# EAGLE design iSkipper.Ver.2.0.2 (EAGLE 9.0.1)
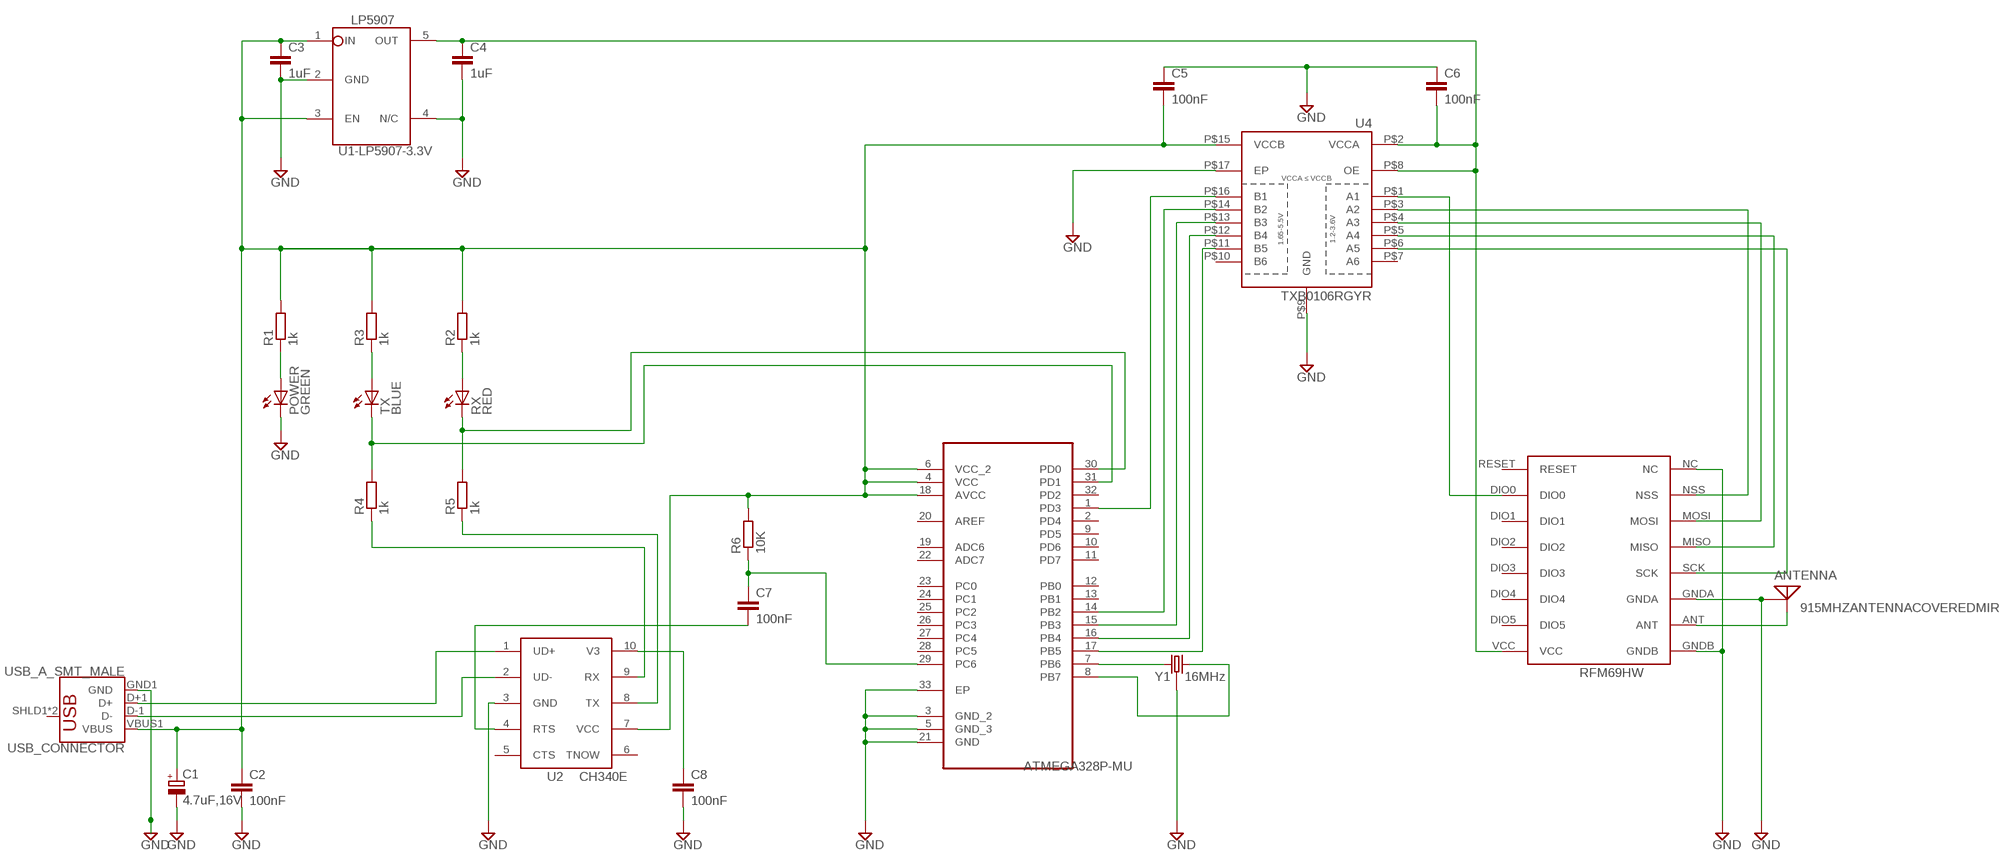
[diagram p0: schematic, sheet 1]

## Parts
ANTENNA  915MHZANTENNACOVEREDMIRROR  [COVERED-MIRROR]
C1  4.7uF,16V  CPOL-EUCT3216  [CT3216]
C2  100nF  CC0603  [C0603]
C3  1uF  CC0603  [C0603]
C4  1uF  CC0603  [C0603]
C5  100nF  CC0603  [C0603]
C6  100nF  CC0603  [C0603]
C7  100nF  CC0603  [C0603]
C8  100nF  CC0603  [C0603]
POWER  GREEN  LEDSML0805  [SML0805]
R1  1k  RR0603  [R0603]
R2  1k  RR0603  [R0603]
R3  1k  RR0603  [R0603]
R4  1k  RR0603  [R0603]
R5  1k  RR0603  [R0603]
R6  10K  RR0603  [R0603]
RFM69HW  RFM69HW  [RFM]
RX  RED  LEDSML0805  [SML0805]
TX  BLUE  LEDSML0805  [SML0805]
U2  CH340ESMD  [MSOP10]
U4  TXB0106RGYR  [VQFN-16]
U$1  U1-LP5907-3.3V  LP5907  [SOT-23]
U$3  ATMEGA328P-MU  [QFN50P500X500X100-33N]
USB_CONNECTOR  USB_A_SMT_MALE  [USB-A-SMT-MALE]
Y1  16MHz  CRYSTAL-GROUNDEDSMD-3.2X2.5  [CRYSTAL-SMD-3.2X2.5MM]

## Nets
GND [Ground]: ANTENNA.P$2(GND) C1.- C2.2 C3.2 C4.2 C5.1 C6.1 C8.2 POWER.C RFM69HW.GNDA RFM69HW.GNDB RFM69HW.NC U2.3(GND) U4.P$9(GND) U4.P$17(EP) U$1.2(GND) U$1.4(N/C) U$3.3(GND_2) U$3.5(GND_3) U$3.21(GND) U$3.33(EP) USB_CONNECTOR.GND1(GND) Y1.2 Y1.4
N$1: U$3.7(PB6) Y1.1
N$2: U$3.8(PB7) Y1.3
N$3 [+5.0V]: C1.+ C2.1 C3.1 C5.2 R1.2 R2.2 R3.2 R6.2 U2.7(VCC) U4.P$15(VCCB) U$1.1(IN) U$1.3(EN) U$3.4(VCC) U$3.6(VCC_2) U$3.18(AVCC) USB_CONNECTOR.VBUS1(VBUS)
N$4: C7.2 U2.4(RTS)
N$5: U2.1(UD+) USB_CONNECTOR.D+1(D+)
N$6 [+3.3V]: C4.1 C6.2 RFM69HW.VCC U4.P$2(VCCA) U4.P$8(OE) U$1.5(OUT)
N$7: POWER.A R1.1
N$8: R3.1 TX.A
N$9: U2.2(UD-) USB_CONNECTOR.D-1(D-)
N$10: R2.1 RX.A
N$11: R5.1 U2.8(TX)
N$12: C8.1 U2.10(V3)
N$13: R4.1 U2.9(RX)
N$14: U4.P$14(B2) U$3.14(PB2)
N$15: R4.2 TX.C U$3.31(PD1)
N$16: R5.2 RX.C U$3.30(PD0)
N$17: U4.P$16(B1) U$3.1(PD3)
N$18: C7.1 R6.1 U$3.29(PC6)
N$19: ANTENNA.P$1(SIGNAL) RFM69HW.ANT
N$22: RFM69HW.SCK U4.P$6(A5)
N$23: RFM69HW.DIO0 U4.P$1(A1)
N$24: RFM69HW.NSS U4.P$3(A2)
N$25: RFM69HW.MISO U4.P$5(A4)
N$26: RFM69HW.MOSI U4.P$4(A3)
N$28: U4.P$11(B5) U$3.17(PB5)
N$29: U4.P$12(B4) U$3.16(PB4)
N$30: U4.P$13(B3) U$3.15(PB3)
Unconnected: RFM69HW.DIO1 RFM69HW.DIO2 RFM69HW.DIO3 RFM69HW.DIO4 RFM69HW.DIO5 RFM69HW.RESET U2.5(CTS) U2.6(TNOW) U4.P$7(A6) U4.P$10(B6) U$3.2(PD4) U$3.9(PD5) U$3.10(PD6) U$3.11(PD7) U$3.12(PB0) U$3.13(PB1) U$3.19(ADC6) U$3.20(AREF) U$3.22(ADC7) U$3.23(PC0) U$3.24(PC1) U$3.25(PC2) U$3.26(PC3) U$3.27(PC4) U$3.28(PC5) U$3.32(PD2) USB_CONNECTOR.SHLD1(SHIELD) USB_CONNECTOR.SHLD2(SHIELD)

## Notes on the sheet
- CH340E

## Library data of the parts
ANTENNA = 915MhzAntenna:915MHZANTENNA
C1 = rcl:CPOL-EU: POLARIZED CAPACITOR, European symbol; SPICEPREFIX: C
C2-C8 = eagle-ltspice:C: CAPACITOR, European symbol; SPICEMODEL: NONE; SPICEPREFIX: C
POWER RX TX = led:LED: LED OSRAM: - CHIPLED LG R971, LG N971, LY N971, LG Q971, LY Q971, LO R971, LY R971 LH N974, LH R974 LS Q976, LO Q976, LY Q976 LO Q996 - Hyper CHIPLED LW Q18S LB Q993, LB Q99A, LB R99A - SideLED LS A670, LO A670, LY A670, LG A670, LP A670 LB A673, LV A673, LT A673, LW A673 LH A674 LY A675 LS A676, LA A676, LO A676, LY A676, LW A676 LS A679, LY A679, LG A679 - Hyper Micro SIDELED® LS Y876, LA Y876, LO Y876, LY Y876 LT Y87S - SmartLED LW L88C, LW L88S LB L89C, LB L89S, LG L890 LS L89K, LO L89K, LY L89K LS L896, LA L896, LO L896, LY L896 - TOPLED LS T670, LO T670, LY T670, LG T670, LP T670 LSG T670, LSP T670, LSY T670, LOP T670, LYG T670 LG T671, LOG T671, LSG T671 LB T673, LV T673, LT T673, LW T673 LH T674 LS T676, LA T676, LO T676, LY T676, LB T676, LH T676, LSB T676, LW T676 LB T67C, LV T67C, LT T67C, LS T67K, LO T67K, LY T67K, LW E67C LS E67B, LA E67B, LO E67B, LY E67B, LB E67C, LV E67C, LT E67C LW T67C LS T679, LY T679, LG T679 LS T770, LO T770, LY T770, LG T770, LP T770 LB T773, LV T773, LT T773, LW T773 LH T774 LS E675, LA E675, LY E675, LS T675 LS T776, LA T776, LO T776, LY T776, LB T776 LHGB T686 LT T68C, LB T68C - Hyper Mini TOPLED® LB M676 - Mini TOPLED Santana® LG M470 LS M47K, LO M47K, LY M47K Source: http://www.osram.convergy.de LUXEON: - LUMILED® LXK2-PW12-R00, LXK2-PW12-S00, LXK2-PW14-U00, LXK2-PW14-V00 LXK2-PM12-R00, LXK2-PM12-S00, LXK2-PM14-U00 LXK2-PE12-Q00, LXK2-PE12-R00, LXK2-PE12-S00, LXK2-PE14-T00, LXK2-PE14-U00 LXK2-PB12-K00, LXK2-PB12-L00, LXK2-PB12-M00, LXK2-PB14-N00, LXK2-PB14-P00, LXK2-PB14-Q00 LXK2-PR12-L00, LXK2-PR12-M00, LXK2-PR14-Q00, LXK2-PR14-R00 LXK2-PD12-Q00, LXK2-PD12-R00, LXK2-PD12-S00 LXK2-PH12-R00, LXK2-PH12-S00 LXK2-PL12-P00, LXK2-PL12-Q00, LXK2-PL12-R00 Source: www.luxeon.com KINGBRIGHT: KA-3528ASYC Source: www.kingbright.com
R1-R6 = eagle-ltspice:R: RESISTOR, European symbol; SPICEMODEL: NONE; SPICEPREFIX: R
RFM69HW = hoperf:RFM69HW; TYPE: RFM69HW
U2 = CH340E:CH340E: WCH.CN/CH340E See DataSheet： wch.cn <http://www.wch.cn/downloads/CH340DS1_PDF.html>
U4 = TXB0106RGYR:TXB0106RGYR
U$1 = ti_lp5907:LP5907: LP5907 Regulator
U$3 = Ava:ATMEGA328P-MU: Programmable Flash; MPN: ATMEGA328P-MU; OC_FARNELL: 1748522; OC_NEWARK: 26R2526; PACKAGE: QFN-32; SUPPLIER: Atmel
USB_CONNECTOR = SparkFun-Connectors:USB_A: USB-A Connector Male and female variants, as well as PTH and SMT variants SparkFun Products: SparkFun XBee Explorer Dongle <https://www.sparkfun.com/products/11697> PTH Male SparkFun MicroView-USB Programmer <https://www.sparkfun.com/products/12924> SMT Male SparkFun USB Type A Female Breakout <https://www.sparkfun.com/products/12700> SMT Female; PROD_ID: CONN-11499
Y1 = SparkFun-Clocks:CRYSTAL-GROUNDED: Crystals w/ Ground Pin (Generic) These are passive quartz crystals, which can be used as a clock source for a microcontroller. Crystal's are usually two-terminal devices. A third terminal may be optionally connected to ground, as recommended by the manufaturer.

## Board
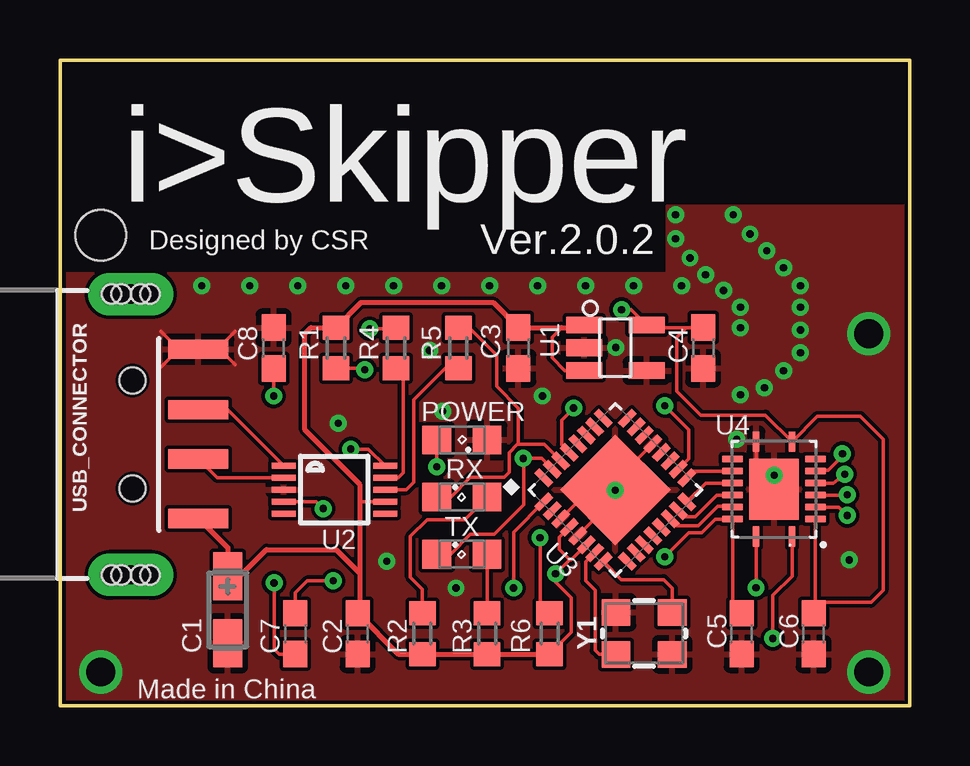
[diagram p1: board, top side]
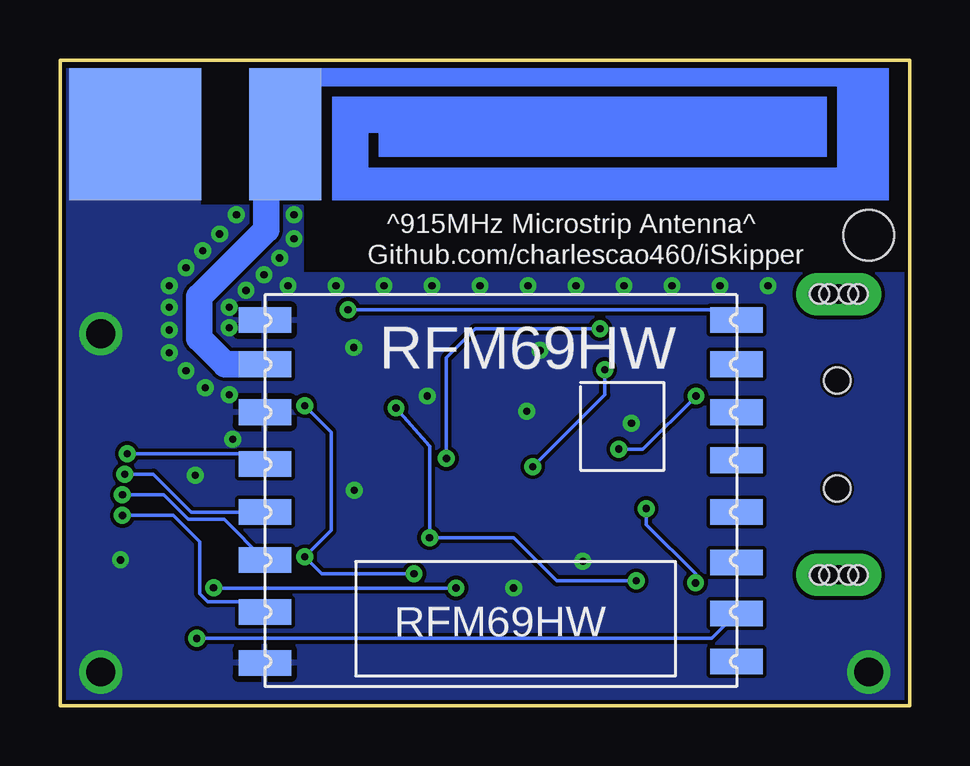
[diagram p2: board, bottom side, seen from below]

Size 35.4 x 26.9 mm. Coordinates in mm from the lower left corner, seen from the top.
Outline: 0,26.9 35.4,26.9 35.4,0 0,0 0,26.9
Copper layers (1*16): Top 0.035mm / dielectric 1.5mm / Bottom 0.035mm
Design rules "default *": minimum track width 6mil, minimum drill 0.3mm, track to track 6mil, track to pad 6mil, pad to pad 6mil, via to via 6mil, smd to smd 6mil, copper to edge 6mil, drill to drill 6mil, minimum pad ring 10mil, minimum via ring 8mil, stop-mask expansion 4mil, vias tented up to drill 20mil, thermal gap 10mil
Holes 2.1 mm at 1.7,19.6

### Footprints (pad centres in the part's own frame; a part is rotated, then mirrored left to right if it is on the bottom)
COVERED-MIRROR = smd 3 x 5.5: P$1 9,2.75 | smd 5.5 x 5.5: P$2 2.75,2.75
CT3216 = smd 2 x 1.2: + -1.4,0; - 1.4,0
C0603 = smd 1.1 x 1: 1 -0.85,0; 2 0.85,0
SML0805 = smd 1.2 x 1.2: A 1.05,0; C -1.05,0
R0603 = smd 1 x 1.1: 1 -0.85,0; 2 0.85,0
RFM = smd 2.184 x 1.067: ANT 19.651,2.889; DIO0 0,13.27; DIO1 0,11.143; DIO2 0,9.047; DIO3 0,6.889; DIO4 0,4.889; DIO5 0,2.889; GNDA 19.651,4.889; GNDB 19.651,1.048; MISO 19.651,9.047; MOSI 19.651,11.047; NC 19.651,15.334; NSS 19.651,13.206; RESET 0,15.27; SCK 19.651,7.048; VCC 0,1.048
MSOP10 = smd 1 x 0.25: 1 -2.113,1; 2 -2.113,0.5; 3 -2.113,0; 4 -2.113,-0.5; 5 -2.113,-1; 6 2.113,-1; 7 2.113,-0.5; 8 2.113,0; 9 2.113,0.5; 10 2.113,1
VQFN-16 = smd 0.85 x 0.28: P$1 -1.975,-0.75; P$8 1.975,-0.75; P$9 1.975,0.75; P$16 -1.975,0.75 | smd 0.28 x 0.85: P$2 -1.25,-1.725; P$3 -0.75,-1.725; P$4 -0.25,-1.725; P$5 0.25,-1.725; P$6 0.75,-1.725; P$7 1.25,-1.725; P$10 1.25,1.725; P$11 0.75,1.725; P$12 0.25,1.725; P$13 -0.25,1.725; P$14 -0.75,1.725; P$15 -1.25,1.725 | smd 2.55 x 2.05: P$17 0,0
SOT-23 = smd 1.5 x 0.7: 1 -1.3,0.95; 2 -1.3,0; 3 -1.3,-0.95; 4 1.3,-0.95; 5 1.3,0.95
QFN50P500X500X100-33N = smd 0.813 x 0.305: 1 -2.464,1.753; 2 -2.464,1.245; 3 -2.464,0.762; 4 -2.464,0.254; 5 -2.464,-0.254; 6 -2.464,-0.762; 7 -2.464,-1.245; 8 -2.464,-1.753; 17 2.464,-1.753; 18 2.464,-1.245; 19 2.464,-0.762; 20 2.464,-0.254; 21 2.464,0.254; 22 2.464,0.762; 23 2.464,1.245; 24 2.464,1.753 | smd 0.305 x 0.813: 9 -1.753,-2.464; 10 -1.245,-2.464; 11 -0.762,-2.464; 12 -0.254,-2.464; 13 0.254,-2.464; 14 0.762,-2.464; 15 1.245,-2.464; 16 1.753,-2.464; 25 1.753,2.464; 26 1.245,2.464; 27 0.762,2.464; 28 0.254,2.464; 29 -0.254,2.464; 30 -0.762,2.464; 31 -1.245,2.464; 32 -1.753,2.464 | smd 3.251 x 3.251: 33 0,0
USB-A-SMT-MALE = smd 2.5 x 0.8: D+1 10.95,1.027; D-1 10.95,-1.027; GND1 10.95,3.551; VBUS1 10.95,-3.5 | drill 0.8 pad 1.778 long: SHLD1 8.13,-5.85; SHLD2 8.13,5.85 | hole 1.1: 8.2,2.25; 8.2,-2.25 | hole 0.8: 8.53,-5.85; 8.93,-5.85; 7.73,-5.85; 7.33,-5.85; 8.53,5.85; 8.93,5.85; 7.73,5.85; 7.33,5.85
CRYSTAL-SMD-3.2X2.5MM = smd 1.2 x 1.1: 1 -1.175,-0.875; 2 1.175,-0.875; 3 1.175,0.875; 4 -1.175,0.875

### Placement (x,y rotation side)
ANTENNA  35.01,21.06 0 bottom
C1  6.99,3.99 270 top
C2  12.4,3 270 top
C3  19.1,14.9 270 top
C4  26.8,14.9 270 top
C5  28.4,3 90 top
C6  31.4,3 90 top
C7  9.8,3 270 top
C8  8.9,14.9 90 top
POWER  16.74,11.07 180 top
R1  11.5,14.9 90 top
R2  15.1,3 270 top
R3  17.8,3 270 top
R4  14,14.9 90 top
R5  16.6,14.9 90 top
R6  20.4,3 270 top
RFM69HW  7.21,17.11 180 bottom
RX  16.74,8.69 0 top
TX  16.74,6.31 0 top
U2  11.43,9 0 top
U4  29.75,9.02 90 top
U$1  23.14,14.91 0 top
U$3  23.14,8.99 45 top
USB_CONNECTOR  -5.18,11.3 0 top
Y1  24.34,3.01 0 top

### Tracks (layer width: path | path; a pad name or v marks a point on that pad's centre or on a via)
GND  (via drill 0.3, 1.2 pad 1.3)
  Top 0.152: U$3.5 23.14,8.63 v23.14,8.97 | U$3.21 23.14,9.35 U$3.33 v23.14,8.97 | U$3.3 21.97,8.9 v23.14,8.97 | U4.P$9 29,10 29.4,9.6 v29.76,9.6 | USB_CONNECTOR.GND1 4.95,14.85 4.2,15.6 | USB_CONNECTOR.GND1 6.55,14.85 7.3,15.6 | USB_CONNECTOR.GND1 6.65,14.85 7.3,14.2 | USB_CONNECTOR.GND1 4.95,14.85 4.2,14.1
  other vias: 32.88,6.07 20.1,12.9 11.59,11.76 13.61,6.01 16.5,4.9 29.35,13.25 30.85,16.6 30.85,17.5 29.45,18.95 26.9,17.95 28.35,15.75 26.25,18.65 27.65,17.3 30.15,18.25 28.75,19.65 28.05,20.45 28.35,16.6 30.15,13.95 15.95,12.26 25.65,19.45 30.85,14.7 25.65,20.45 23.16,14.92 33.7,1.4 1.7,1.4 33.7,15.5 30.85,15.65 28.2,11.1 28.35,12.95 15.4,14.8 5.9,17.5 7.9,17.5 9.9,17.5 11.9,17.5 13.9,17.5 15.9,17.5 17.9,17.5 19.9,17.5 21.9,17.5 23.9,17.5 25.9,17.5
  pour Top (rank 6): -2.1,18 -2.1,-2 42.9,-2 42.9,18
  pour Bottom (rank 6): -3.1,18 44.9,18 44.9,-3 -3.1,-3
  pour Top: 25.3,20.8 25.3,12.7 38.1,12.7 38.1,20.8
  pour Bottom: 25.3,20.8 29.6,20.8 29.6,26.5 36.6,26.5 36.6,12.9 25.3,12.9
N$1
  Top 0.152: U$3.7 21.91,6 21.9,6 21.9,5.2 22.3,4.8 22.3,2.3 22.47,2.13 Y1.1
N$2
  Top 0.152: U$3.8 23.4,5.25 25.15,5.25 25.51,4.89 Y1.3
N$3  (via drill 0.3)
  Top 0.152: U2.7 12.5,8.5 | C5.2 28.02,4.23 U4.P$15 27.3,7.77 26.73,7.2 26.2,7.2 v25.2,6.2 | R6.2 21.3,3.05 21.3,4.5 20.65,5.15 v20.65,5.49 21.23,6.07 | U$3.6 21.3,6.07 21.23,6.07 | U$3.4 20.8,7.01 20.8,6.51 21.23,6.07 | v25.2,12.5 26.2,11.5 26.2,10.29 U$3.18 | 20.9,15.75 20.5,15.35 20.5,14.5 21.04,13.96 U$1.3
  Top 0.2: R6.2 R3.2 R2.2 14.1,2.15 C2.1 12.5,3.95 12.5,5.5 | 12.5,5.5 12.5,8.5 12.5,9.2 10.2,11.5 10.2,15.5 10.45,15.75 R1.2 12.55,16.8 18.05,16.8 C3.1 20.9,15.75 21.73,15.75 U$1.1 | USB_CONNECTOR.VBUS1 6.99,6.58 C1.+ 7.49,5.39 8.6,6.5 11.5,6.5 12.5,5.5
  Bottom 0.152: v20.65,5.49 24.49,5.49 v25.2,6.2 24.1,7.3 24.1,11.4 v25.2,12.5
N$4  (via drill 0.3)
  Top 0.152: U2.4 10.68,8.5 v10.97,8.21 | v8.92,5.11 8.92,2.35 9.14,2.13 9.78,2.13 C7.2
  Bottom 0.152: v10.97,8.21 10.97,7.54 8.92,5.49 v8.92,5.11
N$5
  Top 0.152: U2.1 6.99,12.33 USB_CONNECTOR.D+1
N$6  (via drill 0.3)
  Top 0.152: U4.P$2 31.47,4.3 | 31.47,4.3 31.47,3.92 C6.2 31.45,3.8 | 31.47,4.3 33.8,4.3 34.3,4.8 34.3,11.1 33.35,12.05 31.55,12.05 U4.P$8 29.39,12.1 26.7,12.1 25.7,13.1 25.7,15.35 26.1,15.75 | 26.1,15.75 24.55,15.75 U$1.5 23.8,16.5 v23.4,16.5 | 26.1,15.75 C4.1
  Bottom 0.152: v23.4,16.5 7.65,16.5 RFM69HW.VCC
N$7  (via drill 0.3)
  Top 0.152: 15.77,11.07 POWER.A v15.7,9.95 | v12.7,14 12.65,14.05 R1.1
  Bottom 0.152: v15.7,9.95 12.7,12.95 v12.7,14
N$8
  Top 0.152: TX.A 17.8,6.01 R3.1
N$9
  Top 0.152: U2.2 6.54,9.5 USB_CONNECTOR.D-1
N$10
  Top 0.152: R2.1 15.1,4.85 14.6,5.35 14.6,7.05 15.3,7.75 16.85,7.75 RX.A
N$11
  Top 0.152: U2.8 14.43,9 14.75,9.31 14.75,12.74 16.05,14.05 R5.1
N$12  (via drill 0.3)
  Top 0.152: U2.10 12.85,10.69 v12.12,10.69 | v8.9,12.9 C8.1
  Bottom 0.152: v12.12,10.69 11.11,10.69 v8.9,12.9
N$13
  Top 0.152: U2.9 14.1,9.5 14.3,9.7 14.3,13.75 R4.1
N$14
  Top 0.152: U4.P$14 27.99,8.3 27.4,8.3 26.6,7.5 25.7,7.5 U$3.14
N$15  (via drill 0.3)
  Top 0.152: U$3.31 20.07,10.3 v19.3,10.3 19.32,10.28 19.32,8.37 18.09,7.14 17.1,7.14 16.27,6.31 TX.C | 13.85,15.6 R4.2 13.95,15.7 v12.9,15.7
  Bottom 0.152: v19.3,10.3 19.3,14.5 18.1,15.7 v12.9,15.7
N$16
  Top 0.152: 19.06,10.88 18.72,10.54 18.72,9.73 18.51,9.52 17.1,9.52 16.27,8.69 RX.C | 19.06,10.88 19.1,10.92 19.1,12.4 18.2,13.3 18.2,14.6 17.05,15.75 R5.2 | U$3.30 20.17,10.88 19.06,10.88
N$17  (via drill 0.3)
  Top 0.152: U$3.1 18.9,7.23 v18.9,4.9 | v29,4.91 U4.P$16
  Bottom 0.152: v18.9,4.9 v28.99,4.9 v29,4.91
N$18  (via drill 0.3)
  Top 0.152: v21.4,12.4 20.9,11.9 20.9,10.87 U$3.29 | R6.1 20,4.25 v20,7 | v11.39,5.2 10.3,5.2 9.8,4.7 C7.1
  Bottom 0.152: v21.4,12.4 20,10.8 v20,7 16.5,7 14.7,5.2 v11.39,5.2
N$19
  Bottom 1.1: RFM69HW.ANT 28.52,14.22 29.61,15.31 29.61,17.04 26.81,19.84 26.81,20.84 | 26.81,20.84 26.8,20.84 26.8,21.2 | 26.81,20.84 26.81,23.69 26.6,23.9 26.51,23.81 ANTENNA.P$1
N$22  (via drill 0.3)
  Top 0.152: v32.6,10.5 v32.59,10.5 32.59,10.39 32,9.8 31.5,9.8 U4.P$6
  Bottom 0.152: 26.9,10.1 RFM69HW.SCK 27.3,10.5 v32.6,10.5
N$23  (via drill 0.3)
  Top 0.152: U4.P$1 30.5,5.4 29.7,4.6 v29.7,2.8
  Bottom 0.152: v29.7,2.8 8.25,2.8 RFM69HW.DIO0
N$24  (via drill 0.3)
  Top 0.152: U4.P$3 32.45,8.27 v32.8,7.92
  Bottom 0.152: RFM69HW.NSS 27.28,4.32 29.24,4.32 29.58,4.66 29.58,6.83 30.68,7.92 v32.8,7.92
N$25  (via drill 0.3)
  Top 0.152: U4.P$5 32.23,9.27 v32.7,9.64
  Bottom 0.152: RFM69HW.MISO 29.93,8.06 31.51,9.64 v32.7,9.64
N$26  (via drill 0.3)
  Top 0.152: U4.P$4 32.79,8.77 v32.8,8.78
  Bottom 0.152: 26.92,6 RFM69HW.MOSI 28.56,7.76 30.06,7.76 31.08,8.78 v32.8,8.78
N$28
  Top 0.152: U$3.17 26.4,9.77 U4.P$11
N$29
  Top 0.152: U$3.16 26.9,9.27 U4.P$12
N$30
  Top 0.152: U4.P$13 27.37,8.77 26.46,7.86 26.03,7.86 U$3.15

### Text on the board
tNames: i>Skipper | Designed by CSR | Ver.2.0.2 | U1 | U4 | U3 | Made in China
bNames: ^915MHz Microstrip Antenna^ | Github.com/charlescao460/iSkipper